# Altium schematic sheet Clock_Led_7_thanh_Huynh_Tan_Cuong.SchDoc
size A3; SheetNumber: 1; SheetTotal: 1
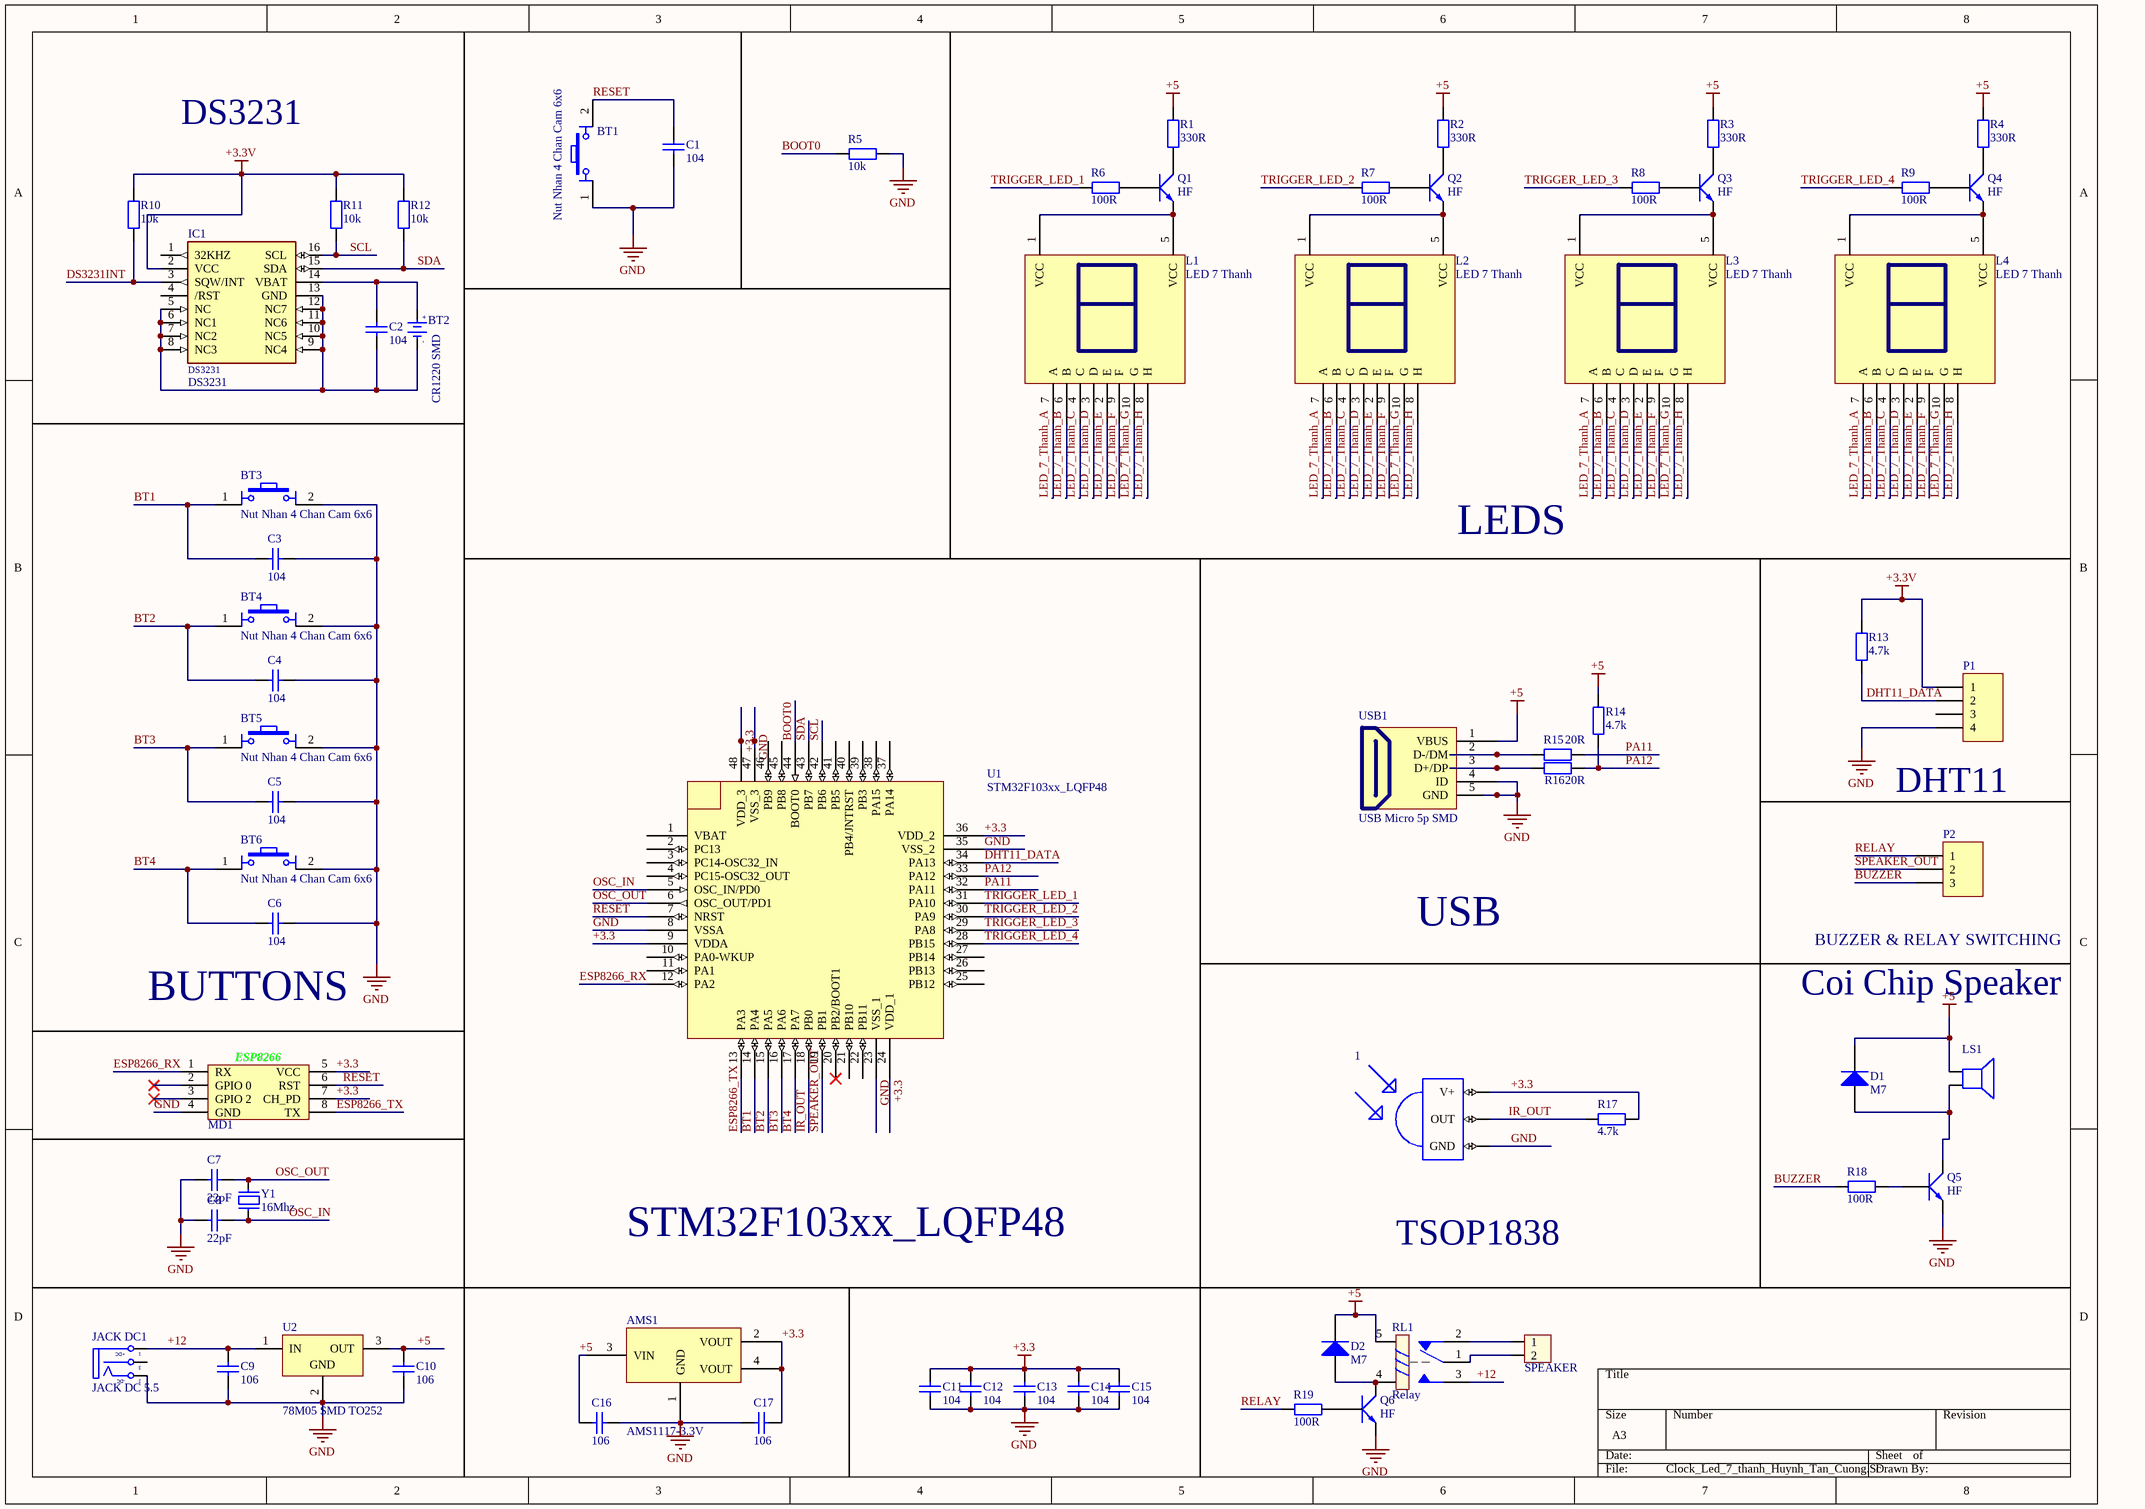
[diagram p0: Clock_Led_7_thanh_Huynh_Tan_Cuong.SchDoc]

## Parts
1  TSOP1838  [TSOP18XX]
AMS1  AMS1117-3.3V  [SOT223]
BT1  Nut Nhan 4 Chan Cam 6x6  [Nut Nhan 4 Chan Cam 6x6]
BT2  CR1220 SMD  [DE PIN CR1220]
BT3  Nut Nhan 4 Chan Cam 6x6  [Nut Nhan 4 Chan Cam 6x6]
BT4  Nut Nhan 4 Chan Cam 6x6  [Nut Nhan 4 Chan Cam 6x6]
BT5  Nut Nhan 4 Chan Cam 6x6  [Nut Nhan 4 Chan Cam 6x6]
BT6  Nut Nhan 4 Chan Cam 6x6  [Nut Nhan 4 Chan Cam 6x6]
C1  104  [tu 0603]
C2  104  [tu 0603]
C3  104  [tu 0603]
C4  104  [tu 0603]
C5  104  [tu 0603]
C6  104  [tu 0603]
C7  22pF  [tu 0603]
C8  22pF  [tu 0603]
C9  106  [tu 0603]
C10  106  [tu 0603]
C11  104  [tu 0603]
C12  104  [tu 0603]
C13  104  [tu 0603]
C14  104  [tu 0603]
C15  104  [tu 0603]
C16  106  [tu 0603]
C17  106  [tu 0603]
D1  M7  [DIODE SMA]
D2  M7  [DIODE SMA]
H1  SPEAKER  [XH2.54M-2]
IC1  DS3231  [SO16W]
JACK_DC1  JACK DC 5.5  [JACK DC 5.5]
L1  LED 7 Thanh  [LED7SEG_2.3inch]
L2  LED 7 Thanh  [LED7SEG_2.3inch]
L3  LED 7 Thanh  [LED7SEG_2.3inch]
L4  LED 7 Thanh  [LED7SEG_2.3inch]
LS1  Coi Chip Speaker  [Coi Chip Speacker]
MD1  ESP8266 Module  [ESP2866 Module]  (value not drawn)
P1  DHT11  [HDR1X4H]
P2  BUZZER & RELAY SWITCHING  [HDR1X3]
Q1  HF  [SOT23]
Q2  HF  [SOT23]
Q3  HF  [SOT23]
Q4  HF  [SOT23]
Q5  HF  [SOT23]
Q6  HF  [SOT23]
R1  330R  [tro smd 0603]
R2  330R  [tro smd 0603]
R3  330R  [tro smd 0603]
R4  330R  [tro smd 0603]
R5  10k  [tro smd 0603]
R6  100R  [tro smd 1206]
R7  100R  [tro smd 1206]
R8  100R  [tro smd 1206]
R9  100R  [tro smd 1206]
R10  10k  [tro smd 0603]
R11  10k  [tro smd 0603]
R12  10k  [tro smd 0603]
R13  4.7k  [tro smd 0603]
R14  4.7k  [tro smd 0603]
R15  20R  [tro smd 1206]
R16  20R  [tro smd 1206]
R17  4.7k  [tro smd 0603]
R18  100R  [tro smd 0603]
R19  100R  [tro smd 0603]
RL1  Relay  [Relay 5 Chan SRD]
U1  STM32F103xx_LQFP48  [STM32_LQPF48]
U2  78M05 SMD TO252  [TO252]
USB1  USB Micro 5p SMD  [USB Micro 5p SMD]
Y1  16Mhz  [Thach Anh 2 chan SMD]

## Nets
+3.3: 1.VCC(V+) AMS1.2(VOUT) AMS1.4(VOUT) C11.1 C12.1 C13.1 C14.1 C15.1 C17.2 MD1.5(VCC) MD1.7(CH_PD) R17.2 U1.9(VDDA) U1.24(VDD_1) U1.36(VDD_2) U1.48(VDD_3)
+3.3V: IC1.2(VCC) P1.1 R10.2 R11.2 R12.2 R13.2
+5: AMS1.3(VIN) C10.1 C16.1 D1.2(K) D2.2(K) LS1.1 R1.2 R2.2 R3.2 R4.2 R14.2 RL1.5 U2.3(OUT) USB1.1(VBUS)
GND: 1.GND AMS1.1(GND) BT1.1 BT3.2 BT4.2 BT5.2 BT6.2 C1.2 C3.2 C4.2 C5.2 C6.2 C7.2 C8.2 C9.2 C10.2 C11.2 C12.2 C13.2 C14.2 C15.2 C16.2 C17.1 JACK_DC1.2(TN) MD1.4(GND) P1.4 Q5.2(E) Q6.2(E) R5.2 U1.8(VSSA) U1.23(VSS_1) U1.35(VSS_2) U1.47(VSS_3) U2.2(GND) USB1.4(ID) USB1.5(GND)
+12: C9.1 JACK_DC1.1(T) RL1.3 U2.1(IN)
BOOT0: R5.1 U1.44(BOOT0)
BT1: BT3.1 C3.1 U1.14(PA4)
BT2: BT4.1 C4.1 U1.15(PA5)
BT3: BT5.1 C5.1 U1.16(PA6)
BT4: BT6.1 C6.1 U1.17(PA7)
BUZZER: P2.3 R18.1
DHT11_DATA: P1.2 R13.1 U1.34(PA13)
DS3231INT: IC1.3(SQW/INT) R10.1
ESP8266_RX: MD1.1(RX) U1.12(PA2)
ESP8266_TX: MD1.8(TX) U1.13(PA3)
IR_OUT: 1.OUT R17.1 U1.18(PB0)
LED_7_Thanh_A: L1.7(A) L2.7(A) L3.7(A) L4.7(A)
LED_7_Thanh_B: L1.6(B) L2.6(B) L3.6(B) L4.6(B)
LED_7_Thanh_C: L1.4(C) L2.4(C) L3.4(C) L4.4(C)
LED_7_Thanh_D: L1.3(D) L2.3(D) L3.3(D) L4.3(D)
LED_7_Thanh_E: L1.2(E) L2.2(E) L3.2(E) L4.2(E)
LED_7_Thanh_F: L1.9(F) L2.9(F) L3.9(F) L4.9(F)
LED_7_Thanh_G: L1.10(G) L2.10(G) L3.10(G) L4.10(G)
LED_7_Thanh_H: L1.8(H) L2.8(H) L3.8(H) L4.8(H)
OSC_IN: C8.1 U1.5(OSC_IN/PD0) Y1.1
OSC_OUT: C7.1 U1.6(OSC_OUT/PD1) Y1.2
PA11: R15.2 U1.32(PA11)
PA12: R14.1 R16.2 U1.33(PA12)
RELAY: P2.1 R19.1
RESET: BT1.2 C1.1 MD1.6(RST) U1.7(NRST)
SCL: IC1.16(SCL) R11.1 U1.42(PB6)
SDA: IC1.15(SDA) R12.1 U1.43(PB7)
SPEAKER_OUT: P2.2 U1.19(PB1)
TRIGGER_LED_1: R6.1 U1.31(PA10)
TRIGGER_LED_2: R7.1 U1.30(PA9)
TRIGGER_LED_3: R8.1 U1.29(PA8)
TRIGGER_LED_4: R9.1 U1.28(PB15)
NetBT2_1: BT2.1(+3V) C2.1 IC1.14(VBAT)
NetBT2_2: BT2.2(GND) C2.2 IC1.5(NC) IC1.6(NC1) IC1.7(NC2) IC1.8(NC3) IC1.9(NC4) IC1.10(NC5) IC1.11(NC6) IC1.12(NC7) IC1.13(GND)
NetD1_1: D1.1(A) LS1.2 Q5.3(C)
NetD2_1: D2.1(A) Q6.3(C) RL1.4
NetH1_1: H1.1 RL1.2
NetH1_2: H1.2 RL1.1
NetL1_1: L1.1(VCC) L1.5(VCC) Q1.2(E)
NetL2_1: L2.1(VCC) L2.5(VCC) Q2.2(E)
NetL3_1: L3.1(VCC) L3.5(VCC) Q3.2(E)
NetL4_1: L4.1(VCC) L4.5(VCC) Q4.2(E)
NetQ1_1: Q1.1(B) R6.2
NetQ1_3: Q1.3(C) R1.1
NetQ2_1: Q2.1(B) R7.2
NetQ2_3: Q2.3(C) R2.1
NetQ3_1: Q3.1(B) R8.2
NetQ3_3: Q3.3(C) R3.1
NetQ4_1: Q4.1(B) R9.2
NetQ4_3: Q4.3(C) R4.1
NetQ5_1: Q5.1(B) R18.2
NetQ6_1: Q6.1(B) R19.2
NetR15_1: R15.1 USB1.2(D-/DM)
NetR16_1: R16.1 USB1.3(D+/DP)

Not connected (* = marked no-connect by the designer): IC1 1(32KHZ) 4(/RST); JACK_DC1 3(S); MD1 2(GPIO_0)* 3(GPIO_2)*; P1 3; U1 1(VBAT) 2(PC13) 3(PC14-OSC32_IN) 4(PC15-OSC32_OUT) 10(PA0-WKUP) 11(PA1) 20(PB2/BOOT1)* 21(PB10) 22(PB11) 25(PB12) 26(PB13) 27(PB14) 37(PA14) 38(PA15) 39(PB3) 40(PB4/JNTRST) 41(PB5) 45(PB8) 46(PB9)

## Notes on the sheet
- DS3231
- LEDS
- USB
- BUTTONS
- STM32F103xx_LQFP48
- (in symbol De pin CR1220 SMD) +; -
- (in symbol ESP8266 Module) ESP8266
- (in symbol JACK DC 5.5) +DC; -DC

## Library data of the parts
1 = TSOP1838: IR Remote Receiver 38KHz 35m 3-Pin; MF: Vishay; Price: None; SnapEDA_Link: https://www.snapeda.com/parts/TSOP1838/Vishay/view-part/561684/?ref=snap; Availability: Unavailable; Value: *; MP: TSOP1838; Package: None
AMS1 = AMS1117 SMD: Dán; Value: AMS1117-3.3V SOT223; Don_Vi: Con; Ma_Hang: MH000596; Ghi_Chu: *; Kieu_Chan: *; Chung_Loai: Dán
BT1 BT3-BT6 = Nut Nhan 4 Chan Cam 6x6: Nut Nhan 4 Chan 6x6mm; Ten: Nút Nhấn 4 Chân 6x6x5MM DIP; Ma_Hang: MH004584
BT2 = De pin CR1220 SMD: Ten: Đế PIN CR1220 SMD; Ma_Hang: MH000833
C1-C6 C11-C15 = Tu 0603 104 50V 10%: Dán; Don_Vi: Con; So_Chan: 2; Ten_Linh_Kien: Tụ 0603 104-100nF 10% 50V; Ma_Hang: MH004568; Chung_Loai: Dán; Kieu_Chan: *
C7 C8 = Tu 0603 22pF 50V 10%: Dán; Don_Vi: Con; So_Chan: 2; Ten_Linh_Kien: Tụ 0603 22pF 50V 10%; Ma_Hang: MH004570; Chung_Loai: Dán; Kieu_Chan: *
C9 C10 C16 C17 = Tu 0603 106 16V 20%: Dán; Don_Vi: Con; So_Chan: 2; Ten_Linh_Kien: Tụ 0603-10uF 20% 16V; Ma_Hang: MH004848; Chung_Loai: Dán; Kieu_Chan: *
D1 D2 = Diode M7 ( 4007 ): Dán; Don_Vi: Con; Ten_Linh_Kien: Diode M7 1N4007 SMD 1A 1000V; Ma_Hang: MH000944; Chung_Loai: Dán; Ghi_Chu: *
H1 = Header 2P 2.54 Duc Thang: Cắm; Ten_Linh_Kien: Header 2P XH2.54-2P Đực Thẳng; Don_Vi: Con; Ma_Hang: MH001283; Chung_Loai: Cắm
IC1 = DS3231: å®žæ—¶æ—¶é’Ÿï¼ˆRTCï¼‰ICæ—¶é’Ÿ/æ—¥åŽ†IÂ²Cï¼Œ2çº¿ä¸²è¡Œ16-SOICï¼ˆ0.295â€œï¼Œ7.50mmå®½åº¦ï¼‰; MF: Maxim Integrated; Value: *; MP: DS3231; Package: SOIC-16 Maxim Integrated; Price: None; SnapEDA_Link: https://www.snapeda.com/parts/DS3231/Maxim%20Integrated/view-part/553791/?ref=snap; Availability: Unavailable
JACK_DC1 = JACK DC 5.5: Value: Jac DC
L1-L4 = LED 7x1 2.3inch Anot: Dán; Don_Vi: Con; Ma_Hang: MH000901; Ten_Linh_Kien: Led 7 2.3 1 Số Anot (Sáng Đỏ); Ghi_Chu: *; Kieu_Chan: *; Chung_Loai: Dán
LS1 = Coi Chip Speaker: Còi chip
P1 = Header 4H: Header, 4-Pin, Right Angle; LatestRevisionDate: 17-Jul-2002; LatestRevisionNote: Re-released for DXP Platform.; Publisher: Altium Limited
P2 = Header 3: Header, 3-Pin; LatestRevisionDate: 17-Jul-2002; LatestRevisionNote: Re-released for DXP Platform.; Publisher: Altium Limited
Q1-Q6 = C1815 HF SMD: NPN transistor; Value: C9014
R1-R4 = Tro 0603 5% 330R: Dán; Don_Vi: Con; Ma_Hang: MH006910; So_Chan: 2; Ten_Linh_Kien: Trở 0603 5% 330R; Chung_Loai: Dán; Kieu_Chan: *
R5 R10-R12 = Tro 0603 1% 10k: Dán; Don_Vi: Con; So_Chan: 2; Ten_Linh_Kien: Trở 0603 1% 10k; Ma_Hang: MH006333; Chung_Loai: Dán; Kieu_Chan: *
R6-R9 = Tro 1206 1% 100R: Dán; So_Chan: 2; Don_Vi: Con; Ten_Linh_Kien: Trở 1206 1% 100R; Ma_Hang: MH005891; Chung_Loai: Dán; Kieu_Chan: *
R13 R14 R17 = Tro 0603 5% 4.7k: Dán; Don_Vi: Con; So_Chan: 2; Ten_Linh_Kien: Trở 0603 5% 4.7k; Ma_Hang: MH006327; Chung_Loai: Dán; Kieu_Chan: *
R15 R16 = Tro 1206 5% 20R: Dán; Don_Vi: Con; So_Chan: 2; Ten_Linh_Kien: Trở 1206 5% 20R; Ma_Hang: MH005911; Chung_Loai: Dán; Kieu_Chan: *
R18 R19 = Tro 0603 5% 100R: Dán; Don_Vi: Con; So_Chan: 2; Ten_Linh_Kien: Trở 0603 5% 100R; Ma_Hang: MH006315; Chung_Loai: Dán; Kieu_Chan: *
RL1 = Relay 5 Chan SRD: Relay 5 Chan; Ma_Hang: MH009374; Ten: Relay 5V10A SRD-05VDC-SL-C Chính Hãng
U2 = 78M05 SMD TO252: Dán; Don_Vi: Con; Ten_Linh_Kien: 78M05 TO252; Ma_Hang: MH001917; Ghi_Chu: *; Kieu_Chan: *; Chung_Loai: Dán
USB1 = USB Micro 5p SMD: USB Type B; Ten: MicroUSB MK5P SMD; Ma_Hang: MH001020
Y1 = Thach Anh 2 chan SMD: Crystal For all Crystal 2pin.; Value: 4Mhz
U1 = STM32F103xx_LQFP48: Published: 30-May-2008; DatasheetVersion: rev6, Mar-2008; PackageVersion: Mar-2008; PackageReference: LQFP48; Publisher: Altium Limited; PackageDescription: 48-Pin Low-Profile Quad Flat Pack, 7 x 7 mm Body, 0.5 mm Pitch (LQFP48); ComponentLink1Description: Manufacturer Link; ComponentLink1URL: www.st.com/stm32; ComponentLink2Description: Datasheet; ComponentLink2URL: http://www.st.com/stonline/products/literature/ds/13587.pdf